# Altium schematic sheet microcontrollerOptical.SchDoc: MICRO-OPTICAL
size A4; DrawnBy: Dylan Vogel; Organization: UTAT SS; DocumentNumber: 2; Revision: 1; SheetNumber: 2; SheetTotal: 7
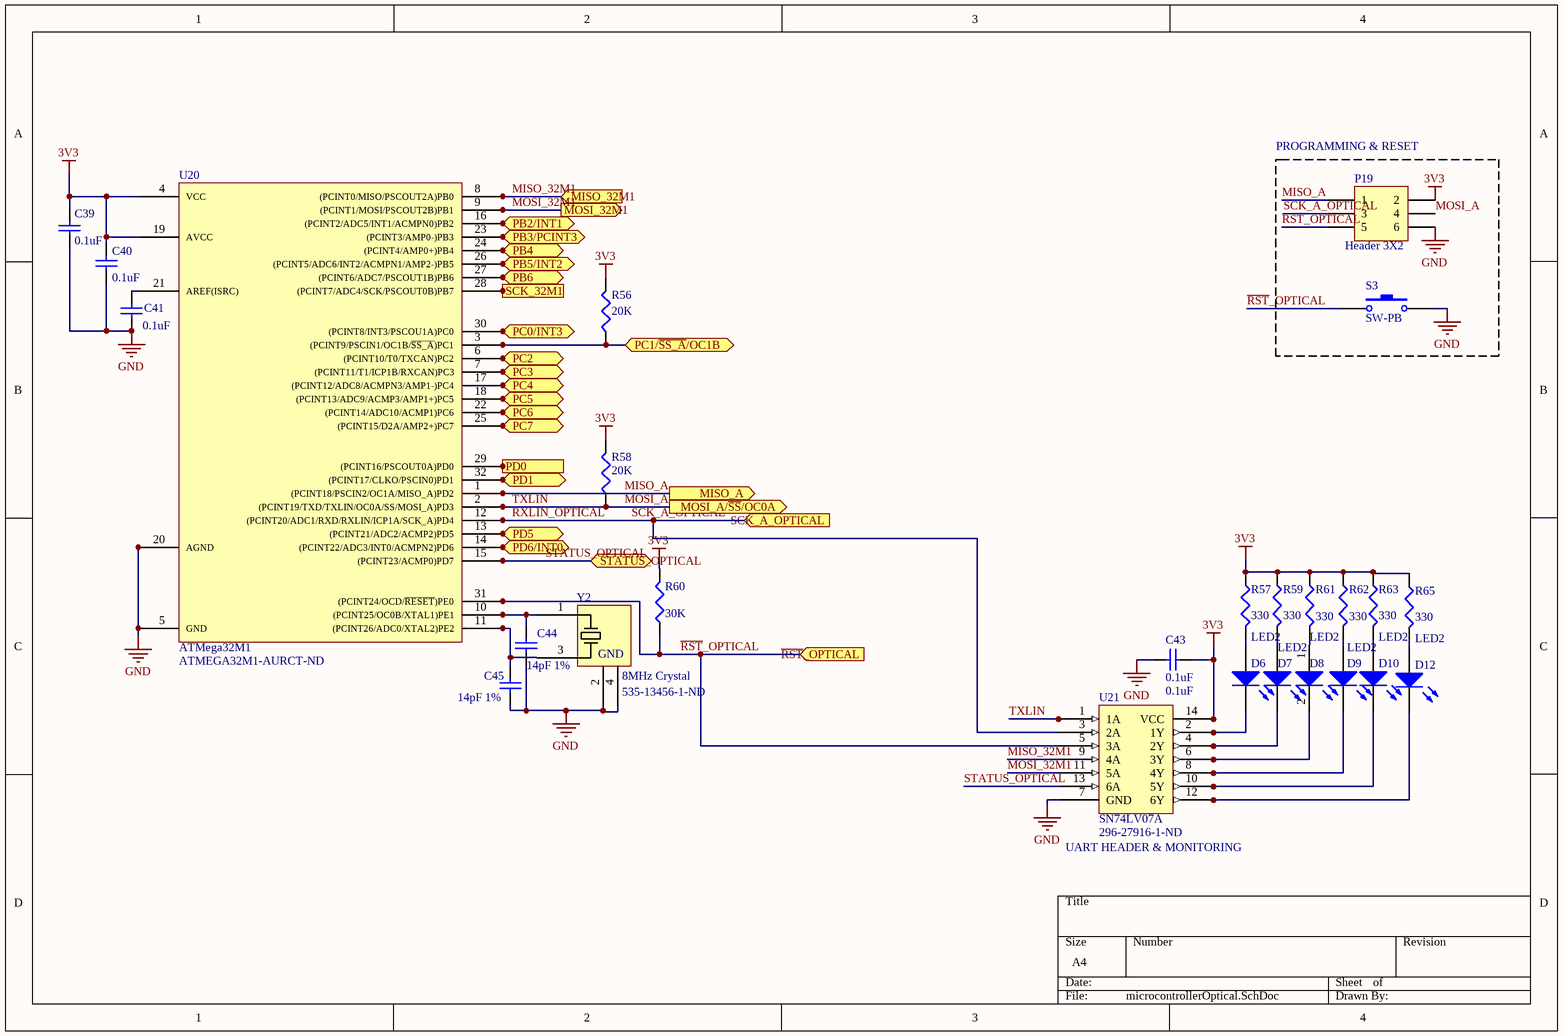
[diagram p0: microcontrollerOptical.SchDoc]

## Parts
C39  0.1uF  [1608[0603]]
C40  0.1uF  [1608[0603]]
C41  0.1uF  [1608[0603]]
C43  0.1uF  [1608[0603]]
C44  value 14pF 1%  [1608[0603]]  (hidden comment: 15pF 1%)
C45  value 14pF 1%  [1608[0603]]  (hidden comment: 15pF 1%)
D6  LED2  [0603-LED]
D7  LED2  [0603-LED]
D8  LED2  [0603-LED]
D9  LED2  [0603-LED]
D10  LED2  [0603-LED]
D12  LED2  [0603-LED]
P19  Header 3X2  [HDR2X3]
R56  20K  [J1-0603]
R57  330  [J1-0603]
R58  20K  [J1-0603]
R59  330  [J1-0603]
R60  30K  [J1-0603]
R61  330  [J1-0603]
R62  330  [J1-0603]
R63  330  [J1-0603]
R65  330  [J1-0603]
S3  SW-PB  [Pushbutton]
U20  ATMega32M1  Supplier Part Number 1: ATMEGA32M1-AURCT-ND  [QFP80P900X900X120-32N]
U21  SN74LV07A  Supplier Part Number: 296-27916-1-ND  [SOP65P640X120-14N]
Y2  8MHz Crystal  Supplier Part Number 1: 535-13456-1-ND  [OSCSC500X320X110-4N]

## Blocks framed on the sheet
PROGRAMMING & RESET: P19 S3

## Ports
MISO_32M1 (in), MISO_A (out), MOSI_32M1 (out), MOSI_A/~{SS}/OC0A (out), PB2/INT1 (bidir), PB3/PCINT3 (bidir), PB4 (bidir), PB5/INT2 (bidir), PB6 (bidir), PC0/INT3 (bidir), PC1/~{SS_A}/OC1B (bidir), PC2 (bidir), PC3 (bidir), PC4 (bidir), PC5 (bidir), PC6 (bidir), PC7 (bidir), PD0 (out), PD1 (bidir), PD5 (bidir), PD6/INT0 (bidir), SCK_32M1 (out), SCK_A_OPTICAL (in), STATUS_OPTICAL (bidir), ~{RST}_OPTICAL (in)

## Nets
3V3: C39.2 C40.2 C43.2 P19.2 R56.2 R57.1 R58.2 R59.1 R60.2 R61.1 R62.1 R63.1 R65.1 U20.4(VCC) U20.19(AVCC) U21.14(VCC)
GND: C39.1 C40.1 C41.2 C43.1 C44.1 C45.1 P19.6 S3.2 U20.5(GND) U20.20(AGND) U21.7(GND) Y2.2 Y2.4
MISO_32M1: U20.8((PCINT0/MISO/PSCOUT2A)PB0) U21.9(4A) ; port MISO_32M1
MISO_A: P19.1 U20.1((PCINT18/PSCIN2/OC1A/MISO_A)PD2) ; port MISO_A
MOSI_32M1: U20.9((PCINT1/MOSI/PSCOUT2B)PB1) U21.11(5A) ; port MOSI_32M1
MOSI_A: P19.4 R58.1 U20.2((PCINT19/TXD/TXLIN/OC0A/SS/MOSI_A)PD3) U21.1(1A) ; port MOSI_A/~{SS}/OC0A  [also labelled TXLIN]
PB2/INT1: U20.16((PCINT2/ADC5/INT1/ACMPN0)PB2) ; port PB2/INT1
PB3/PCINT3: U20.23((PCINT3/AMP0-)PB3) ; port PB3/PCINT3
PB4: U20.24((PCINT4/AMP0+)PB4) ; port PB4
PB5/INT2: U20.26((PCINT5/ADC6/INT2/ACMPN1/AMP2-)PB5) ; port PB5/INT2
PB6: U20.27((PCINT6/ADC7/PSCOUT1B)PB6) ; port PB6
PC0/INT3: U20.30((PCINT8/INT3/PSCOU1A)PC0) ; port PC0/INT3
PC1/~{SS_A}/OC1B: R56.1 U20.3((PCINT9/PSCIN1/OC1B/~{SS_A})PC1) ; port PC1/~{SS_A}/OC1B
PC2: U20.6((PCINT10/T0/TXCAN)PC2) ; port PC2
PC3: U20.7((PCINT11/T1/ICP1B/RXCAN)PC3) ; port PC3
PC4: U20.17((PCINT12/ADC8/ACMPN3/AMP1-)PC4) ; port PC4
PC5: U20.18((PCINT13/ADC9/ACMP3/AMP1+)PC5) ; port PC5
PC6: U20.22((PCINT14/ADC10/ACMP1)PC6) ; port PC6
PC7: U20.25((PCINT15/D2A/AMP2+)PC7) ; port PC7
PD0: U20.29((PCINT16/PSCOUT0A)PD0) ; port PD0
PD1: U20.32((PCINT17/CLKO/PSCIN0)PD1) ; port PD1
PD5: U20.13((PCINT21/ADC2/ACMP2)PD5) ; port PD5
PD6/INT0: U20.14((PCINT22/ADC3/INT0/ACMPN2)PD6) ; port PD6/INT0
~{RST}_OPTICAL: P19.5 R60.1 S3.1 U20.31((PCINT24/OCD/~{RESET})PE0) U21.5(3A) ; port ~{RST}_OPTICAL
RXLIN_OPTICAL: P19.3 U20.12((PCINT20/ADC1/RXD/RXLIN/ICP1A/SCK_A)PD4) U21.3(2A) ; port SCK_A_OPTICAL  [also labelled SCK_A_OPTICAL]
SCK_32M1: U20.28((PCINT7/ADC4/SCK/PSCOUT0B)PB7) ; port SCK_32M1
STATUS_OPTICAL: U20.15((PCINT23/ACMP0)PD7) U21.13(6A) ; port STATUS_OPTICAL
NetC41_1: C41.1 U20.21(AREF(ISRC))
NetC44_2: C44.2 U20.10((PCINT25/OC0B/XTAL1)PE1) Y2.1(IN)
NetC45_2: C45.2 U20.11((PCINT26/ADC0/XTAL2)PE2) Y2.3(IN)
NetD6_1: D6.1(A) R57.2
NetD6_2: D6.2(K) U21.2(1Y)
NetD7_1: D7.1(A) R59.2
NetD7_2: D7.2(K) U21.4(2Y)
NetD8_1: D8.1(A) R61.2
NetD8_2: D8.2(K) U21.6(3Y)
NetD9_1: D9.1(A) R62.2
NetD9_2: D9.2(K) U21.8(4Y)
NetD10_1: D10.1(A) R63.2
NetD10_2: D10.2(K) U21.10(5Y)
NetD12_1: D12.1(A) R65.2
NetD12_2: D12.2(K) U21.12(6Y)

## Notes on the sheet
- (near U21) UART HEADER & MONITORING
- (in symbol 8MHz Abracom 4-Pin Crystal) GND

## Library data of the parts
C39-C41 C43-C45 = Cap Semi: Capacitor (Semiconductor SIM Model); Published: 8-Jun-2000; LatestRevisionDate: 29-May-2009; LatestRevisionNote: IPC-7351 Footprint Added.; PackageReference: C1206; Publisher: Altium Limited; PackageDescription: Chip Capacitor; Supplier: Digi-Key; Supplier 1: Digi-Key
  C39-C41 C43: Value: 0.1uF; Supplier Part Number: 311-1341-1-ND
  C44 C45: Supplier Part Number: 490-16416-1-ND
D6-D10 D12 = LED2: Typical RED, GREEN, YELLOW, AMBER GaAs LED; Published: 8-Jun-2000; LatestRevisionDate: 17-Jul-2002; LatestRevisionNote: Re-released for DXP Platform.; PackageVersion: Feb-2002; PackageReference: 3.2X1.6X1.1; Publisher: Altium Limited; PackageDescription: SM LED; 2 Flat Leads; Supplier: Digi-Key; Supplier 1: Digi-Key
P19 = Header 3X2: Header, 3-Pin, Dual row; LatestRevisionDate: 17-Jul-2002; LatestRevisionNote: Re-released for DXP Platform.; Publisher: Altium Limited; Supplier: Digi-Key; Supplier 1: Digi-Key; Supplier Part Number: SAM1034-03-ND
R56-R63 R65 = Res3: Resistor; Published: 8-Jun-2000; LatestRevisionDate: 29-May-2009; LatestRevisionNote: IPC-7351 Footprint Added.; PackageReference: J1-0603; Publisher: Altium Limited; PackageDescription: Chip Resistor; Supplier: Digi-Key; Supplier 1: Digi-Key
  R56 R58: Value: 20K; Supplier Part Number: RMCF0603FT20K0CT-ND
  R57 R59 R61-R63 R65: Value: 330; Supplier Part Number: 1276-4604-1-ND
  R60: Value: 30K; Supplier Part Number: RMCF0603JT30K0CT-ND
S3 = SW-PB: Switch; Published: 24-Mar-1999; LatestRevisionDate: 17-Jul-2002; LatestRevisionNote: Re-released for DXP Platform.; PackageReference: SPST-2; Publisher: Altium Limited; PackageDescription: Switch; 2 Leads; Supplier Part Number: CKN10587CT-ND; Supplier 1: Digi-Key; Supplier: Digi-Key
U20 = ATMega32M1: Atmel 8-bit AVR microcontroller.; Supplier 1: Digi-Key; Supplier: Digi-Key; Supplier Part Number: ATMEGA32M1-AURCT-ND
U21 = SN74LV07A: Six element 1-bit non-inverting open-drain buffer.; Supplier: Digi-Key; Supplier 1: Digi-Key
Y2 = 8MHz Abracom 4-Pin Crystal: 8MHz Abracom 4-pin crystal.; Supplier 1: Digi-Key; Supplier Part Number: 535-13456-1-ND; Supplier: Digi-Key